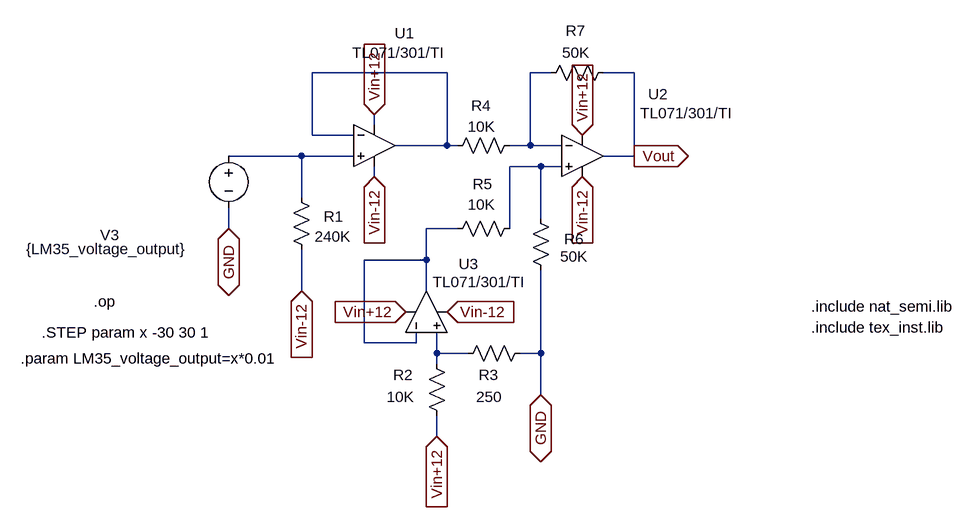
[diagram p0: schematic Component_1.asc]
Component_1.asc, the LTspice schematic file:
Version 4.1
SHEET 1 1044 752
WIRE 240 48 32 48
WIRE 400 48 368 48
WIRE 528 48 480 48
WIRE 128 128 128 112
WIRE 32 144 32 48
WIRE 96 144 32 144
WIRE 240 160 240 48
WIRE 240 160 160 160
WIRE 256 160 240 160
WIRE 368 160 368 48
WIRE 368 160 336 160
WIRE 416 160 368 160
WIRE 16 176 -96 176
WIRE 96 176 16 176
WIRE 528 176 528 48
WIRE 528 176 480 176
WIRE 384 192 336 192
WIRE 416 192 384 192
WIRE 128 208 128 192
WIRE 16 240 16 176
WIRE 384 272 384 192
WIRE -96 288 -96 256
WIRE 256 288 208 288
WIRE 336 288 336 192
WIRE 208 336 208 288
WIRE 208 336 112 336
WIRE 16 384 16 320
WIRE 208 384 208 336
WIRE 112 464 112 336
WIRE 192 464 192 448
WIRE 192 464 112 464
WIRE 224 480 224 448
WIRE 272 480 224 480
WIRE 384 480 384 352
WIRE 384 480 352 480
WIRE 224 496 224 480
WIRE 384 544 384 480
WIRE 224 608 224 576
FLAG 448 208 Vin-12
IOPIN 448 208 In
FLAG 128 208 Vin-12
IOPIN 128 208 In
FLAG 240 416 Vin-12
IOPIN 240 416 In
FLAG 176 416 Vin+12
IOPIN 176 416 In
FLAG 128 112 Vin+12
IOPIN 128 112 In
FLAG 448 144 Vin+12
IOPIN 448 144 In
FLAG 16 384 Vin-12
IOPIN 16 384 In
FLAG 224 608 Vin+12
IOPIN 224 608 In
FLAG 384 544 GND
IOPIN 384 544 BiDir
FLAG -96 288 GND
IOPIN -96 288 BiDir
FLAG 528 176 Vout
IOPIN 528 176 Out
SYMBOL Opamps\\opamp2 128 96 R0
WINDOW 0 31 -109 Left 2
WINDOW 3 -34 -79 Left 2
SYMATTR InstName U1
SYMATTR Value TL071/301/TI
SYMBOL voltage -96 160 R0
WINDOW 3 -312 159 Left 2
WINDOW 123 0 0 Left 2
WINDOW 39 0 0 Left 2
WINDOW 0 -198 138 Left 2
SYMATTR Value {LM35_voltage_output}
SYMATTR InstName V3
SYMBOL Opamps\\opamp2 448 112 R0
WINDOW 0 101 -31 Left 2
WINDOW 3 89 -2 Left 2
SYMATTR InstName U2
SYMATTR Value TL071/301/TI
SYMBOL Opamps\\opamp2 144 416 R270
WINDOW 0 74 114 VRight 2
WINDOW 3 46 74 VRight 2
SYMATTR InstName U3
SYMATTR Value TL071/301/TI
SYMBOL res 0 224 R0
WINDOW 0 50 45 Left 2
SYMATTR InstName R1
SYMATTR Value 240K
SYMBOL res 208 480 R0
WINDOW 0 -51 33 Left 2
WINDOW 3 -61 67 Left 2
SYMATTR InstName R2
SYMATTR Value 10K
SYMBOL res 368 464 R90
WINDOW 0 65 64 VBottom 2
WINDOW 3 67 63 VTop 2
SYMATTR InstName R3
SYMATTR Value 250
SYMBOL res 352 144 R90
WINDOW 0 -30 60 VBottom 2
WINDOW 3 -29 59 VTop 2
SYMATTR InstName R4
SYMATTR Value 10K
SYMBOL res 352 272 R90
WINDOW 0 -37 57 VBottom 2
WINDOW 3 -37 59 VTop 2
SYMATTR InstName R5
SYMATTR Value 10K
SYMBOL res 368 256 R0
WINDOW 0 52 48 Left 2
WINDOW 3 46 75 Left 2
SYMATTR InstName R6
SYMATTR Value 50K
SYMBOL res 496 32 R90
WINDOW 0 -33 58 VBottom 2
WINDOW 3 -31 58 VTop 2
SYMATTR InstName R7
SYMATTR Value 50K
TEXT 800 408 Left 2 !.include nat_semi.lib
TEXT -384 448 Left 2 !.STEP param x -30 30 1
TEXT -304 400 Left 2 !.op
TEXT 800 440 Left 2 !.include tex_inst.lib
TEXT -416 488 Left 2 !.param LM35_voltage_output=x*0.01

The netlist it stands for:
* Component_1.asc
X§U1 N003 N001 Vin+12 Vin-12 N001 TL071/301/TI  ; pins In+ In- V+ V- OUT
V3 N003 GND {LM35_voltage_output}
X§U2 N004 N002 Vin+12 Vin-12 Vout TL071/301/TI  ; pins In+ In- V+ V- OUT
X§U3 N006 N005 Vin+12 Vin-12 N005 TL071/301/TI  ; pins In+ In- V+ V- OUT
R1 N003 Vin-12 240K
R2 N006 Vin+12 10K
R3 GND N006 250
R4 N002 N001 10K
R5 N004 N005 10K
R6 N004 GND 50K
R7 Vout N002 50K
.include nat_semi.lib
.STEP param x -30 30 1
.op
.include tex_inst.lib
.param LM35_voltage_output=x*0.01
.backanno
.end